# Altium schematic sheet FEV-60_Motor_Driver.SchDoc
size B; Revision: A0
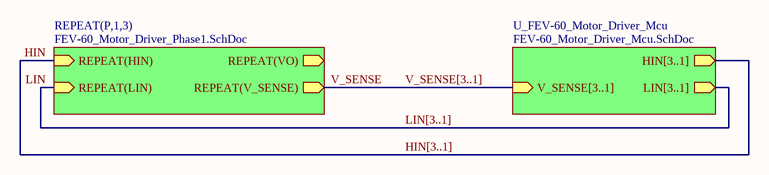
[diagram p0: FEV-60_Motor_Driver.SchDoc]

## Sub-sheets
REPEAT(P,1,3) = FEV-60_Motor_Driver_Phase1.SchDoc: REPEAT(HIN) (in), REPEAT(LIN) (in), REPEAT(V_SENSE) (out), REPEAT(VO) (out)
U_FEV-60_Motor_Driver_Mcu = FEV-60_Motor_Driver_Mcu.SchDoc: V_SENSE[3..1] (in), HIN[3..1] (out), LIN[3..1] (out)

## Nets
HIN: sheet REPEAT(P,1,3)/REPEAT(HIN)
LIN: sheet REPEAT(P,1,3)/REPEAT(LIN)
V_SENSE: sheet REPEAT(P,1,3)/REPEAT(V_SENSE)

## Buses and harness runs
bus HIN[3..1] = sheet U_FEV-60_Motor_Driver_Mcu/HIN[3..1]
bus LIN[3..1] = sheet U_FEV-60_Motor_Driver_Mcu/LIN[3..1]
bus V_SENSE[3..1] = sheet U_FEV-60_Motor_Driver_Mcu/V_SENSE[3..1]

## Notes on the sheet
- Title
- Date:
- Revision:
- Number:
- Team Skytanic
- Sheet
- of
- Senior Design
- 2019/2020
- File: